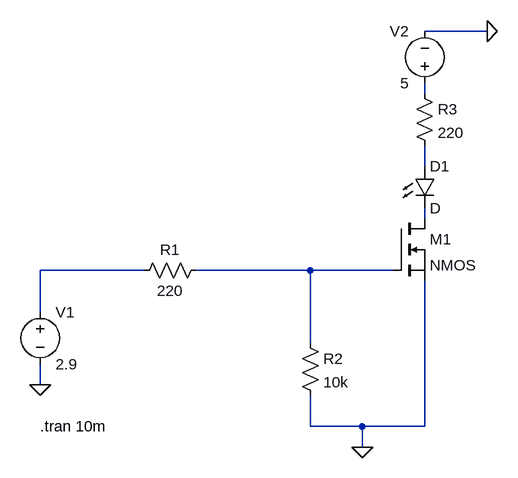
[diagram p0: schematic mos.asc]
mos.asc, the LTspice schematic file:
Version 4
SHEET 1 880 680
WIRE 848 -304 752 -304
WIRE 752 -208 752 -224
WIRE 752 -96 752 -128
WIRE 752 -16 752 -32
WIRE 320 64 160 64
WIRE 576 64 400 64
WIRE 704 64 576 64
WIRE 160 128 160 64
WIRE 576 176 576 64
WIRE 160 240 160 208
WIRE 576 304 576 256
WIRE 656 304 576 304
WIRE 752 304 752 80
WIRE 752 304 656 304
WIRE 656 336 656 304
FLAG 656 336 0
FLAG 848 -304 0
FLAG 160 240 0
SYMBOL voltage 160 112 R0
WINDOW 123 0 0 Left 0
WINDOW 39 0 0 Left 0
SYMATTR InstName V1
SYMATTR Value 2.9
SYMBOL res 416 48 R90
WINDOW 0 0 56 VBottom 2
WINDOW 3 32 56 VTop 2
SYMATTR InstName R1
SYMATTR Value 220
SYMBOL res 560 160 R0
SYMATTR InstName R2
SYMATTR Value 10k
SYMBOL res 736 -224 R0
SYMATTR InstName R3
SYMATTR Value 220
SYMBOL voltage 752 -208 R180
WINDOW 0 24 96 Left 2
WINDOW 3 24 16 Left 2
WINDOW 123 0 0 Left 0
WINDOW 39 0 0 Left 0
SYMATTR InstName V2
SYMATTR Value 5
SYMBOL nmos 704 -16 R0
SYMATTR InstName M1
SYMBOL LED 736 -96 R0
SYMATTR InstName D1
TEXT 160 304 Left 2 !.tran 10m

The netlist it stands for:
* mos.asc
V1 N004 0 2.9
R1 N005 N004 220
R2 N005 0 10k
R3 N001 N002 220
V2 N001 0 5
M1 N003 N005 0 0 NMOS
D1 N002 N003 D
.model D D
.lib standard.dio
.model NMOS NMOS
.model PMOS PMOS
.lib standard.mos
.tran 10m
.backanno
.end